# EAGLE design interconnexions (EAGLE 6.3)
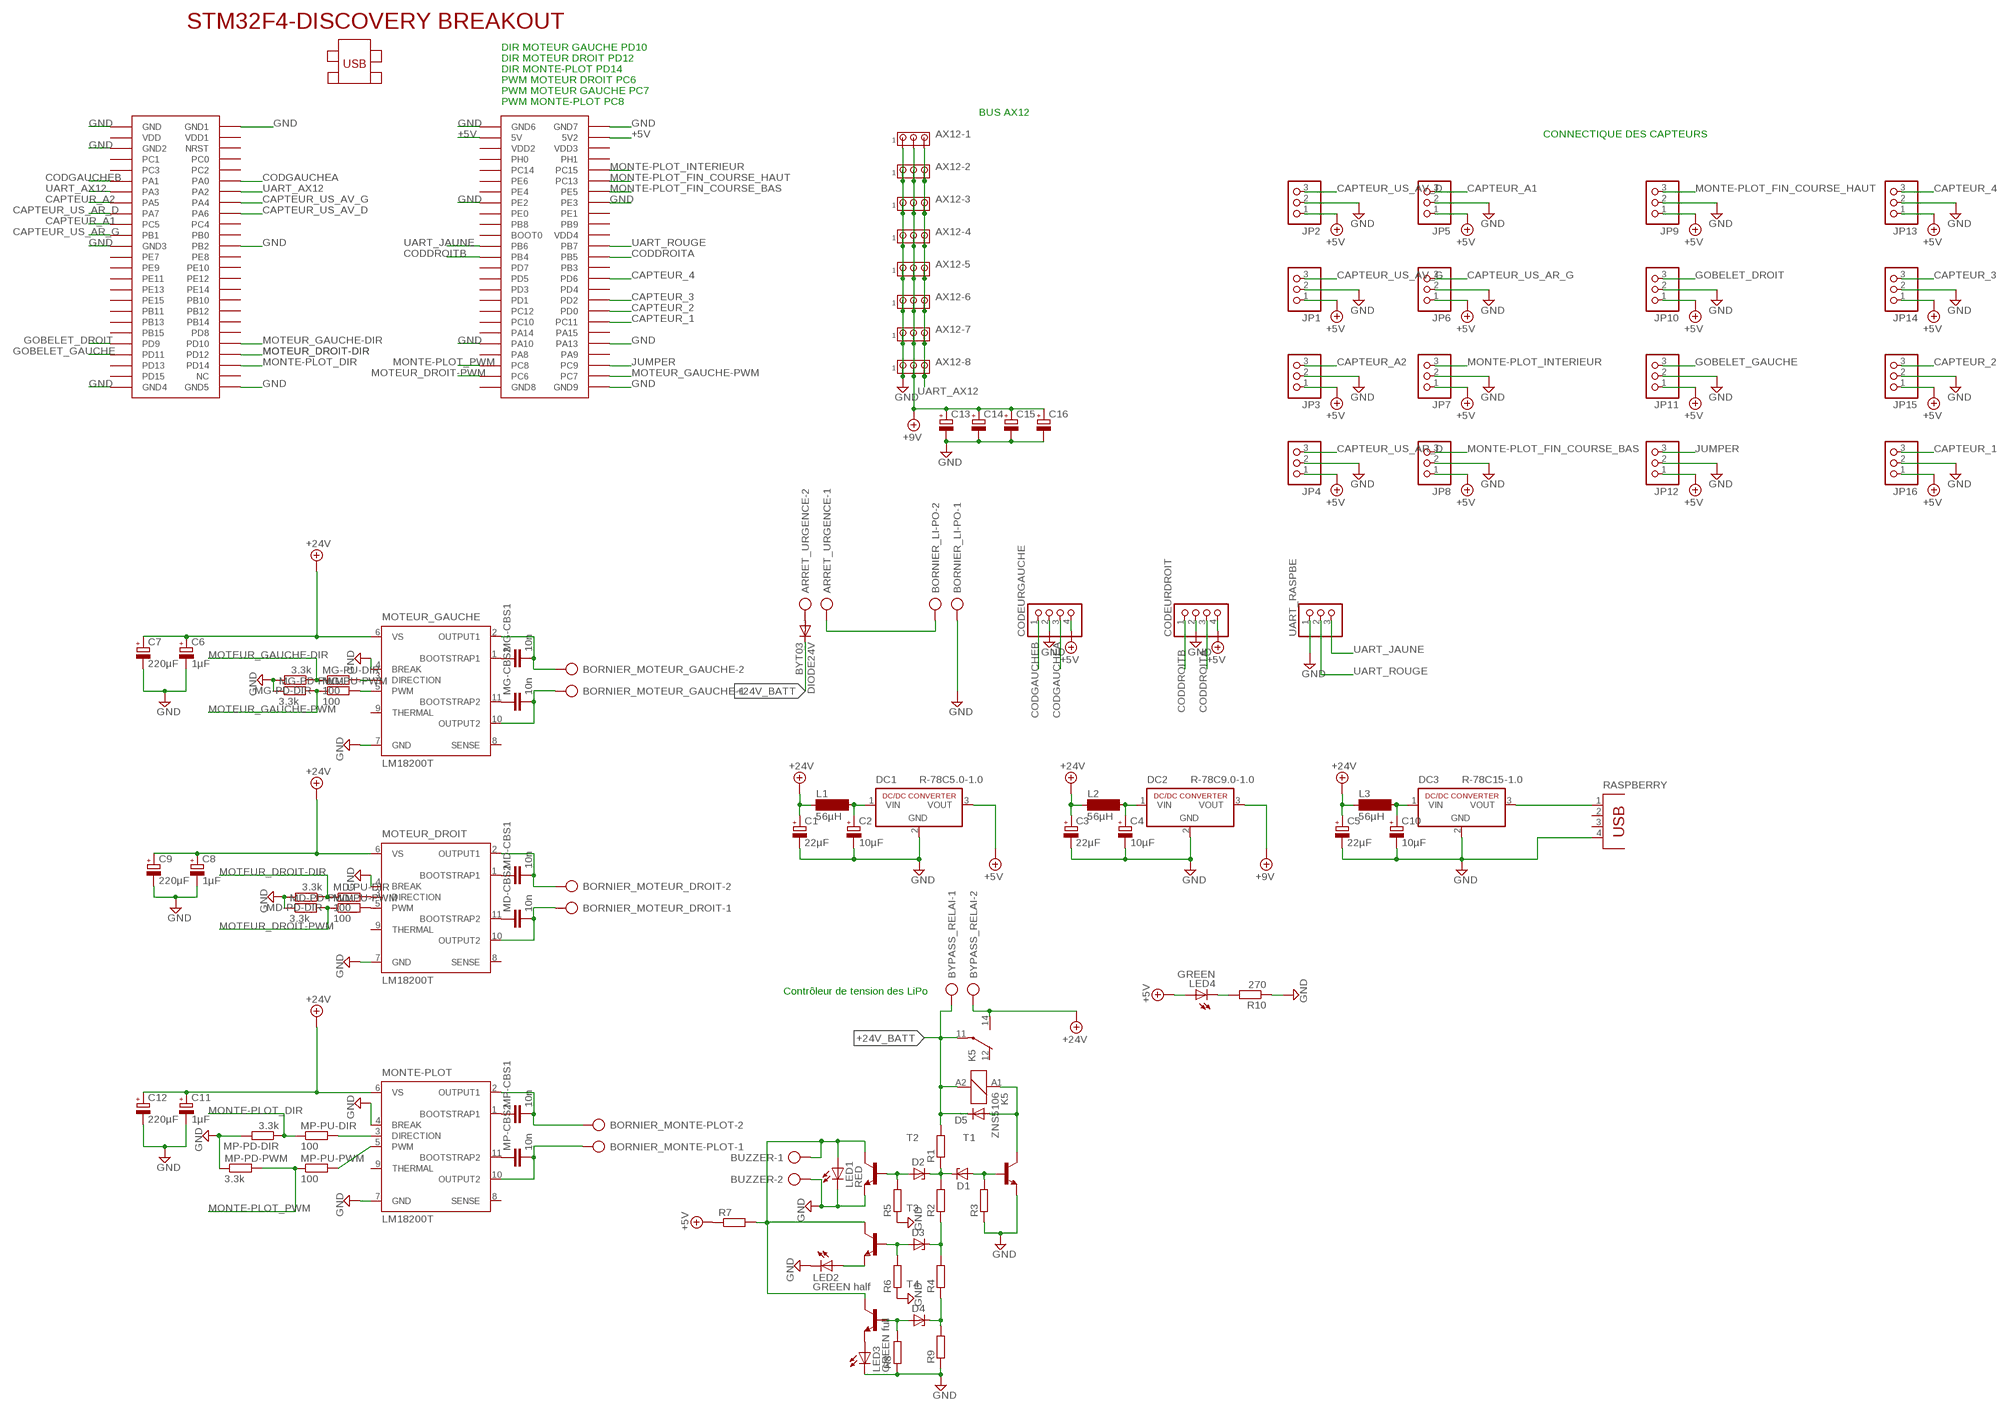
[diagram p0: schematic, sheet 1]

## Parts
ARRET_URGENCE  AK300/2  [AK300/2]
AX12-1  MTA03-100  [10X03MTA]
AX12-2  MTA03-100  [10X03MTA]
AX12-3  MTA03-100  [10X03MTA]
AX12-4  MTA03-100  [10X03MTA]
AX12-5  MTA03-100  [10X03MTA]
AX12-6  MTA03-100  [10X03MTA]
AX12-7  MTA03-100  [10X03MTA]
AX12-8  MTA03-100  [10X03MTA]
BORNIER_LI-PO  AK300/2  [AK300/2]
BORNIER_MONTE-PLOT  AK300/2  [AK300/2]
BORNIER_MOTEUR_DROIT  AK300/2  [AK300/2]
BORNIER_MOTEUR_GAUCHE  AK300/2  [AK300/2]
BUZZER  AK300/2  [AK300/2]
BYPASS_RELAI  AK300/2  [AK300/2]
C1  22µF  CPOL-EUE2,5-6E  [E2,5-6E]
C2  10µF  CPOL-EUE2,5-6E  [E2,5-6E]
C3  22µF  CPOL-EUE2,5-6E  [E2,5-6E]
C4  10µF  CPOL-EUE2,5-6E  [E2,5-6E]
C5  22µF  CPOL-EUE2,5-6E  [E2,5-6E]
C6  1µF  CPOL-EUE3.5-8  [E3,5-8]
C7  220µF  CPOL-EUE3.5-8  [E3,5-8]
C8  1µF  CPOL-EUE3.5-8  [E3,5-8]
C9  220µF  CPOL-EUE3.5-8  [E3,5-8]
C10  10µF  CPOL-EUE2,5-6E  [E2,5-6E]
C11  1µF  CPOL-EUE3.5-8  [E3,5-8]
C12  220µF  CPOL-EUE3.5-8  [E3,5-8]
C13  CPOL-EUE2,5-6E  [E2,5-6E]
C14  CPOL-EUE2,5-6E  [E2,5-6E]
C15  CPOL-EUE2,5-6E  [E2,5-6E]
C16  CPOL-EUE2,5-6E  [E2,5-6E]
CODEURDROIT  PINHD-1X4  [1X04]
CODEURGAUCHE  PINHD-1X4  [1X04]
D1  ZENER-DIODEZD-2.5  [ZDIO-2.5]
D2  ZENER-DIODEZD-2.5  [ZDIO-2.5]
D3  ZENER-DIODEZD-2.5  [ZDIO-2.5]
D4  ZENER-DIODEZD-2.5  [ZDIO-2.5]
D5  DIODE-D-2.5  [D-2.5]
DC1  R-78C5.0-1.0  [SIP3]
DC2  R-78C9.0-1.0  [SIP3]
DC3  R-78C15-1.0  [SIP3]
DIODE24V  BYT03  [DO27-15]
JP1  PINHD-1X3  [1X03]
JP2  PINHD-1X3  [1X03]
JP3  PINHD-1X3  [1X03]
JP4  PINHD-1X3  [1X03]
JP5  PINHD-1X3  [1X03]
JP6  PINHD-1X3  [1X03]
JP7  PINHD-1X3  [1X03]
JP8  PINHD-1X3  [1X03]
JP9  PINHD-1X3  [1X03]
JP10  PINHD-1X3  [1X03]
JP11  PINHD-1X3  [1X03]
JP12  PINHD-1X3  [1X03]
JP13  PINHD-1X3  [1X03]
JP14  PINHD-1X3  [1X03]
JP15  PINHD-1X3  [1X03]
JP16  PINHD-1X3  [1X03]
K5  ZNS5106  [ZN5]
L1  56µH  SD12K100  [SD12K100]
L2  56µH  SD12K100  [SD12K100]
L3  56µH  SD12K100  [SD12K100]
LED1  RED  LED5MM  [LED5MM]
LED2  GREEN half  LED5MM  [LED5MM]
LED3  GREEN full  LED5MM  [LED5MM]
LED4  GREEN  LED5MM  [LED5MM]
MD-CBS1  10n  C-EU050-025X075  [C050-025X075]
MD-CBS2  10n  C-EU050-025X075  [C050-025X075]
MD-PD-DIR  3.3k  R-EU_0207/10  [0207/10]
MD-PD-PWM  3.3k  R-EU_0207/7  [0207/7]
MD-PU-DIR  100  R-EU_0207/7  [0207/7]
MD-PU-PWM  100  R-EU_0207/15  [0207/15]
MG-CBS1  10n  C-EU050-025X075  [C050-025X075]
MG-CBS2  10n  C-EU050-025X075  [C050-025X075]
MG-PD-DIR  3.3k  R-EU_0207/7  [0207/7]
MG-PD-PWM  3.3k  R-EU_0207/7  [0207/7]
MG-PU-DIR  100  R-EU_0207/7  [0207/7]
MG-PU-PWM  100  R-EU_0207/15  [0207/15]
MONTE-PLOT  LM18200T  [TO-220-11]
MOTEUR_DROIT  LM18200T  [TO-220-11]
MOTEUR_GAUCHE  LM18200T  [TO-220-11]
MP-CBS1  10n  C-EU050-025X075  [C050-025X075]
MP-CBS2  10n  C-EU050-025X075  [C050-025X075]
MP-PD-DIR  3.3k  R-EU_0207/10  [0207/10]
MP-PD-PWM  3.3k  R-EU_0207/7  [0207/7]
MP-PU-DIR  100  R-EU_0207/7  [0207/7]
MP-PU-PWM  100  R-EU_0207/15  [0207/15]
R1  R-EU_0207/2V  [0207/2V]
R2  R-EU_0204/7  [0204/7]
R3  R-EU_0207/2V  [0207/2V]
R4  R-EU_0204/7  [0204/7]
R5  R-EU_0207/2V  [0207/2V]
R6  R-EU_0207/2V  [0207/2V]
R7  R-EU_0204/7  [0204/7]
R8  R-EU_0204/5  [0204/5]
R9  R-EU_0204/7  [0204/7]
R10  270  R-EU_0207/2V  [0207/2V]
RASPBERRY  PN87520  [PN87520]
T1  2N5400-NPN-TO92-CBE  [TO92-CBE]
T2  2N5400-NPN-TO92-CBE  [TO92-CBE]
T3  2N5400-NPN-TO92-CBE  [TO92-CBE]
T4  2N5400-NPN-TO92-CBE  [TO92-CBE]
U$1  STM32F4-DISCOVERY  [STM32F4-DISCOVERY]
UART_RASPBE  PINHD-1X3  [1X03]

## Nets
+5V: CODEURDROIT.4 CODEURGAUCHE.4 DC1.3(VOUT) JP1.1 JP2.1 JP3.1 JP4.1 JP5.1 JP6.1 JP7.1 JP8.1 JP9.1 JP10.1 JP11.1 JP12.1 JP13.1 JP14.1 JP15.1 JP16.1 LED4.A R7.1 U$1.P$53(5V) U$1.P$54(5V2)
+9V: AX12-1.2 AX12-2.2 AX12-3.2 AX12-4.2 AX12-5.2 AX12-6.2 AX12-7.2 AX12-8.2 C13.+ C14.+ C15.+ C16.+ DC2.3(VOUT)
+15V: DC3.3(VOUT) RASPBERRY.1
+24V: BYPASS_RELAI.2 C1.+ C3.+ C5.+ C6.+ C7.+ C8.+ C9.+ C11.+ C12.+ K5.14(2:S) L1.1 L2.1 L3.1 MONTE-PLOT.6(VS) MOTEUR_DROIT.6(VS) MOTEUR_GAUCHE.6(VS)
+24V_BATT: BYPASS_RELAI.1 D5.C DIODE24V.C K5.11(2:P) K5.A2 R1.2
CAPTEUR_1: JP16.3 U$1.P$88(PC11)
CAPTEUR_2: JP15.3 U$1.P$86(PD0)
CAPTEUR_3: JP14.3 U$1.P$84(PD2)
CAPTEUR_4: JP13.3 U$1.P$80(PD6)
CAPTEUR_A1: JP5.3 U$1.P$19(PC5)
CAPTEUR_A2: JP3.3 U$1.P$15(PA5)
CAPTEUR_US_AR_D: JP4.3 U$1.P$17(PA7)
CAPTEUR_US_AR_G: JP6.3 U$1.P$21(PB1)
CAPTEUR_US_AV_D: JP2.3 U$1.P$18(PA6)
CAPTEUR_US_AV_G: JP1.3 U$1.P$16(PA4)
CODDROITA: CODEURDROIT.3 U$1.P$76(PB5)
CODDROITB: CODEURDROIT.1 U$1.P$75(PB4)
CODGAUCHEA: CODEURGAUCHE.3 U$1.P$12(PA0)
CODGAUCHEB: CODEURGAUCHE.1 U$1.P$11(PA1)
GND: AX12-1.1 AX12-2.1 AX12-3.1 AX12-4.1 AX12-5.1 AX12-6.1 AX12-7.1 AX12-8.1 BORNIER_LI-PO.1 BUZZER.2 C1.- C2.- C3.- C4.- C5.- C6.- C7.- C8.- C9.- C10.- C11.- C12.- C13.- C14.- C15.- C16.- CODEURDROIT.2 CODEURGAUCHE.2 DC1.2(GND) DC2.2(GND) DC3.2(GND) JP1.2 JP2.2 JP3.2 JP4.2 JP5.2 JP6.2 JP7.2 JP8.2 JP9.2 JP10.2 JP11.2 JP12.2 JP13.2 JP14.2 JP15.2 JP16.2 LED1.K(C) LED2.K(C) LED3.K(C) MD-PD-DIR.2 MD-PD-PWM.1 MG-PD-DIR.2 MG-PD-PWM.1 MONTE-PLOT.4(BREAK) MONTE-PLOT.7(GND) MOTEUR_DROIT.4(BREAK) MOTEUR_DROIT.7(GND) MOTEUR_GAUCHE.4(BREAK) MOTEUR_GAUCHE.7(GND) MP-PD-DIR.2 MP-PD-PWM.1 R3.1 R5.1 R6.1 R8.1 R9.1 R10.1 RASPBERRY.4 T1.E T2.E U$1.P$1(GND) U$1.P$2(GND1) U$1.P$5(GND2) U$1.P$23(GND3) U$1.P$24(PB2) U$1.P$49(GND4) U$1.P$50(GND5) U$1.P$51(GND6) U$1.P$52(GND7) U$1.P$65(PE2) U$1.P$66(PE3) U$1.P$91(PA10) U$1.P$92(PA13) U$1.P$100(GND9) UART_RASPBE.1
GOBELET_DROIT: JP10.3 U$1.P$41(PD9)
GOBELET_GAUCHE: JP11.3 U$1.P$43(PD11)
JUMPER: JP12.3 U$1.P$96(PC9)
MONTE-PLOT_DIR: MP-PD-DIR.1 MP-PU-DIR.1 U$1.P$46(PD14)
MONTE-PLOT_FIN_COURSE_BAS: JP8.3 U$1.P$64(PE5)
MONTE-PLOT_FIN_COURSE_HAUT: JP9.3 U$1.P$62(PC13)
MONTE-PLOT_INTERIEUR: JP7.3 U$1.P$60(PC15)
MONTE-PLOT_PWM: MP-PD-PWM.2 MP-PU-PWM.1 U$1.P$95(PC8)
MOTEUR_DROIT-DIR: MD-PD-DIR.1 MD-PU-DIR.1 U$1.P$44(PD12)
MOTEUR_DROIT-PWM: MD-PD-PWM.2 MD-PU-PWM.1 U$1.P$97(PC6)
MOTEUR_GAUCHE-DIR: MG-PD-DIR.1 MG-PU-DIR.1 U$1.P$42(PD10)
MOTEUR_GAUCHE-PWM: MG-PD-PWM.2 MG-PU-PWM.1 U$1.P$98(PC7)
N$1: C2.+ DC1.1(VIN) L1.2
N$2: C4.+ DC2.1(VIN) L2.2
N$3: C10.+ DC3.1(VIN) L3.2
N$4: MONTE-PLOT.1(BOOTSTRAP1) MP-CBS1.1
N$5: MG-CBS1.1 MOTEUR_GAUCHE.1(BOOTSTRAP1)
N$6: MG-CBS2.1 MOTEUR_GAUCHE.11(BOOTSTRAP2)
N$7: MD-CBS2.1 MOTEUR_DROIT.11(BOOTSTRAP2)
N$8: MD-CBS1.1 MOTEUR_DROIT.1(BOOTSTRAP1)
N$9: BORNIER_MOTEUR_DROIT.2 MD-CBS1.2 MOTEUR_DROIT.2(OUTPUT1)
N$10: BORNIER_MOTEUR_DROIT.1 MD-CBS2.2 MOTEUR_DROIT.10(OUTPUT2)
N$11: BORNIER_MOTEUR_GAUCHE.1 MG-CBS2.2 MOTEUR_GAUCHE.10(OUTPUT2)
N$12: BORNIER_MOTEUR_GAUCHE.2 MG-CBS1.2 MOTEUR_GAUCHE.2(OUTPUT1)
N$13: MONTE-PLOT.11(BOOTSTRAP2) MP-CBS2.1
N$14: MG-PU-DIR.2 MOTEUR_GAUCHE.3(DIRECTION)
N$15: MG-PU-PWM.2 MOTEUR_GAUCHE.5(PWM)
N$16: MD-PU-DIR.2 MOTEUR_DROIT.3(DIRECTION)
N$17: MD-PU-PWM.2 MOTEUR_DROIT.5(PWM)
N$18: BORNIER_MONTE-PLOT.1 MONTE-PLOT.10(OUTPUT2) MP-CBS2.2
N$19: BORNIER_MONTE-PLOT.2 MONTE-PLOT.2(OUTPUT1) MP-CBS1.2
N$20: MONTE-PLOT.3(DIRECTION) MP-PU-DIR.2
N$21: MONTE-PLOT.5(PWM) MP-PU-PWM.2
N$22: LED4.K(C) R10.2
N$23: ARRET_URGENCE.1 BORNIER_LI-PO.2
N$24: D5.A K5.A1 T1.C
N$25: D1.C D2.C R1.1 R2.2
N$26: D1.A R3.2 T1.B
N$27: D2.A R5.2 T2.B
N$28: BUZZER.1 LED1.A R7.2 T2.C T3.C T4.C
N$29: D3.C R2.1 R4.2
N$30: LED2.A T3.E
N$31: D3.A R6.2 T3.B
N$32: LED3.A T4.E
N$33: D4.C R4.1 R9.2
N$34: D4.A R8.2 T4.B
N$38: ARRET_URGENCE.2 DIODE24V.A
UART_AX12: AX12-1.3 AX12-2.3 AX12-3.3 AX12-4.3 AX12-5.3 AX12-6.3 AX12-7.3 AX12-8.3 U$1.P$13(PA3) U$1.P$14(PA2)
UART_JAUNE: U$1.P$73(PB6) UART_RASPBE.3
UART_ROUGE: U$1.P$74(PB7) UART_RASPBE.2
Unconnected: K5.12(2:O) MONTE-PLOT.8(SENSE) MONTE-PLOT.9(THERMAL) MOTEUR_DROIT.8(SENSE) MOTEUR_DROIT.9(THERMAL) MOTEUR_GAUCHE.8(SENSE) MOTEUR_GAUCHE.9(THERMAL) RASPBERRY.2 RASPBERRY.3 U$1.P$3(VDD) U$1.P$4(VDD1) U$1.P$6(NRST) U$1.P$7(PC1) U$1.P$8(PC0) U$1.P$9(PC3) U$1.P$10(PC2) U$1.P$20(PC4) U$1.P$22(PB0) U$1.P$25(PE7) U$1.P$26(PE8) U$1.P$27(PE9) U$1.P$28(PE10) U$1.P$29(PE11) U$1.P$30(PE12) U$1.P$31(PE13) U$1.P$32(PE14) U$1.P$33(PE15) U$1.P$34(PB10) U$1.P$35(PB11) U$1.P$36(PB12) U$1.P$37(PB13) U$1.P$38(PB14) U$1.P$39(PB15) U$1.P$40(PD8) U$1.P$45(PD13) U$1.P$47(PD15) U$1.P$48(NC) U$1.P$55(VDD2) U$1.P$56(VDD3) U$1.P$57(PH0) U$1.P$58(PH1) U$1.P$59(PC14) U$1.P$61(PE6) U$1.P$63(PE4) U$1.P$67(PE0) U$1.P$68(PE1) U$1.P$69(PB8) U$1.P$70(PB9) U$1.P$71(BOOT0) U$1.P$72(VDD4) U$1.P$77(PD7) U$1.P$78(PB3) U$1.P$79(PD5) U$1.P$81(PD3) U$1.P$82(PD4) U$1.P$83(PD1) U$1.P$85(PC12) U$1.P$87(PC10) U$1.P$89(PA14) U$1.P$90(PA15) U$1.P$93(PA8) U$1.P$94(PA9) U$1.P$99(GND8)

## Notes on the sheet
- DIR MOTEUR GAUCHE PD10
- DIR MOTEUR DROIT PD12
- DIR MONTE-PLOT PD14
- PWM MOTEUR DROIT PC6
- PWM MOTEUR GAUCHE PC7
- PWM MONTE-PLOT PC8
- BUS AX12
- CONNECTIQUE DES CAPTEURS
- Contrôleur de tension des LiPo

## Library data of the parts
ARRET_URGENCE BORNIER_LI-PO BORNIER_MONTE-PLOT BORNIER_MOTEUR_DROIT BORNIER_MOTEUR_GAUCHE BUZZER BYPASS_RELAI = con-ptr500:AK300/2: CONNECTOR; OC_FARNELL: unknown; OC_NEWARK: unknown
AX12-1-AX12-8 = con-amp:MTA03-100: AMP connector
C1-C5 C10 C13-C16 = resistor:CPOL-EU: POLARIZED CAPACITOR, European symbol
C6-C9 C11 C12 = rcl:CPOL-EU: POLARIZED CAPACITOR, European symbol
CODEURDROIT CODEURGAUCHE = pinhead:PINHD-1X4: PIN HEADER
D1-D4 = diode:ZENER-DIODE: Z-Diode
D5 = diode:DIODE-: DIODE
DC1-DC3 = dc-dc-converter:R-78C*-1.0: INNOLINE DC/DC-Converter 1.0 AMP SIP3 Single Output Source: Data sheet <http://www.mikrocontroller.net/attachment/150645/157764-da-01-en-DC_DC_WANDLER_R_78C5_0_1_0.pdf>
DIODE24V = diode:BYT03: DIODE ultra fast
JP1-JP16 UART_RASPBE = pinhead:PINHD-1X3: PIN HEADER
K5 = relay:ZNS5*: Miniature Power PCB Relay SCHRACK 1pole 10 A Source: http://www.schrack.com/.. 5847.pdf; OC_FARNELL: unknown; OC_NEWARK: unknown
L1-L3 = inductor-neosid:SD12: INDUCTOR nominal inductance; OC_FARNELL: unknown; OC_NEWARK: unknown
LED1-LED4 = led:LED: LED OSRAM: - CHIPLED LG R971, LG N971, LY N971, LG Q971, LY Q971, LO R971, LY R971 LH N974, LH R974 LS Q976, LO Q976, LY Q976 LO Q996 - Hyper CHIPLED LW Q18S LB Q993, LB Q99A, LB R99A - SideLED LS A670, LO A670, LY A670, LG A670, LP A670 LB A673, LV A673, LT A673, LW A673 LH A674 LY A675 LS A676, LA A676, LO A676, LY A676, LW A676 LS A679, LY A679, LG A679 - Hyper Micro SIDELED® LS Y876, LA Y876, LO Y876, LY Y876 LT Y87S - SmartLED LW L88C, LW L88S LB L89C, LB L89S, LG L890 LS L89K, LO L89K, LY L89K LS L896, LA L896, LO L896, LY L896 - TOPLED LS T670, LO T670, LY T670, LG T670, LP T670 LSG T670, LSP T670, LSY T670, LOP T670, LYG T670 LG T671, LOG T671, LSG T671 LB T673, LV T673, LT T673, LW T673 LH T674 LS T676, LA T676, LO T676, LY T676, LB T676, LH T676, LSB T676, LW T676 LB T67C, LV T67C, LT T67C, LS T67K, LO T67K, LY T67K, LW E67C LS E67B, LA E67B, LO E67B, LY E67B, LB E67C, LV E67C, LT E67C LW T67C LS T679, LY T679, LG T679 LS T770, LO T770, LY T770, LG T770, LP T770 LB T773, LV T773, LT T773, LW T773 LH T774 LS E675, LA E675, LY E675, LS T675 LS T776, LA T776, LO T776, LY T776, LB T776 LHGB T686 LT T68C, LB T68C - Hyper Mini TOPLED® LB M676 - Mini TOPLED Santana® LG M470 LS M47K, LO M47K, LY M47K Source: http://www.osram.convergy.de LUXEON: - LUMILED® LXK2-PW12-R00, LXK2-PW12-S00, LXK2-PW14-U00, LXK2-PW14-V00 LXK2-PM12-R00, LXK2-PM12-S00, LXK2-PM14-U00 LXK2-PE12-Q00, LXK2-PE12-R00, LXK2-PE12-S00, LXK2-PE14-T00, LXK2-PE14-U00 LXK2-PB12-K00, LXK2-PB12-L00, LXK2-PB12-M00, LXK2-PB14-N00, LXK2-PB14-P00, LXK2-PB14-Q00 LXK2-PR12-L00, LXK2-PR12-M00, LXK2-PR14-Q00, LXK2-PR14-R00 LXK2-PD12-Q00, LXK2-PD12-R00, LXK2-PD12-S00 LXK2-PH12-R00, LXK2-PH12-S00 LXK2-PL12-P00, LXK2-PL12-Q00, LXK2-PL12-R00 Source: www.luxeon.com KINGBRIGHT: KA-3528ASYC Source: www.kingbright.com
MD-CBS1 MD-CBS2 MG-CBS1 MG-CBS2 MP-CBS1 MP-CBS2 = rcl:C-EU: CAPACITOR, European symbol
MD-PD-DIR MD-PU-DIR MG-PD-DIR MG-PU-DIR MP-PD-DIR MP-PU-DIR R1 R8 R10 = rcl:R-EU_: RESISTOR, European symbol
MD-PD-PWM MD-PU-PWM MG-PD-PWM MG-PU-PWM MP-PD-PWM MP-PU-PWM R2-R7 R9 = resistor:R-EU_: RESISTOR, European symbol
MONTE-PLOT MOTEUR_DROIT MOTEUR_GAUCHE = national-semiconductor:LM18200T: 3A, 55V H-Bridge Motor Control SourcE: http://cache.national.com/ds/LM/LMD18200.pdf; OC_FARNELL: unknown; OC_NEWARK: unknown
RASPBERRY = con-berg:PN87520: BERG USB connector; OC_FARNELL: unknown; OC_NEWARK: unknown
T1-T4 = transistor:*-NPN-: NPN Transistror BF959 corrected 2008.03.06
U$1 = STM32F4-DISCOVERY:STM32F4-DISCOVERY

## Board
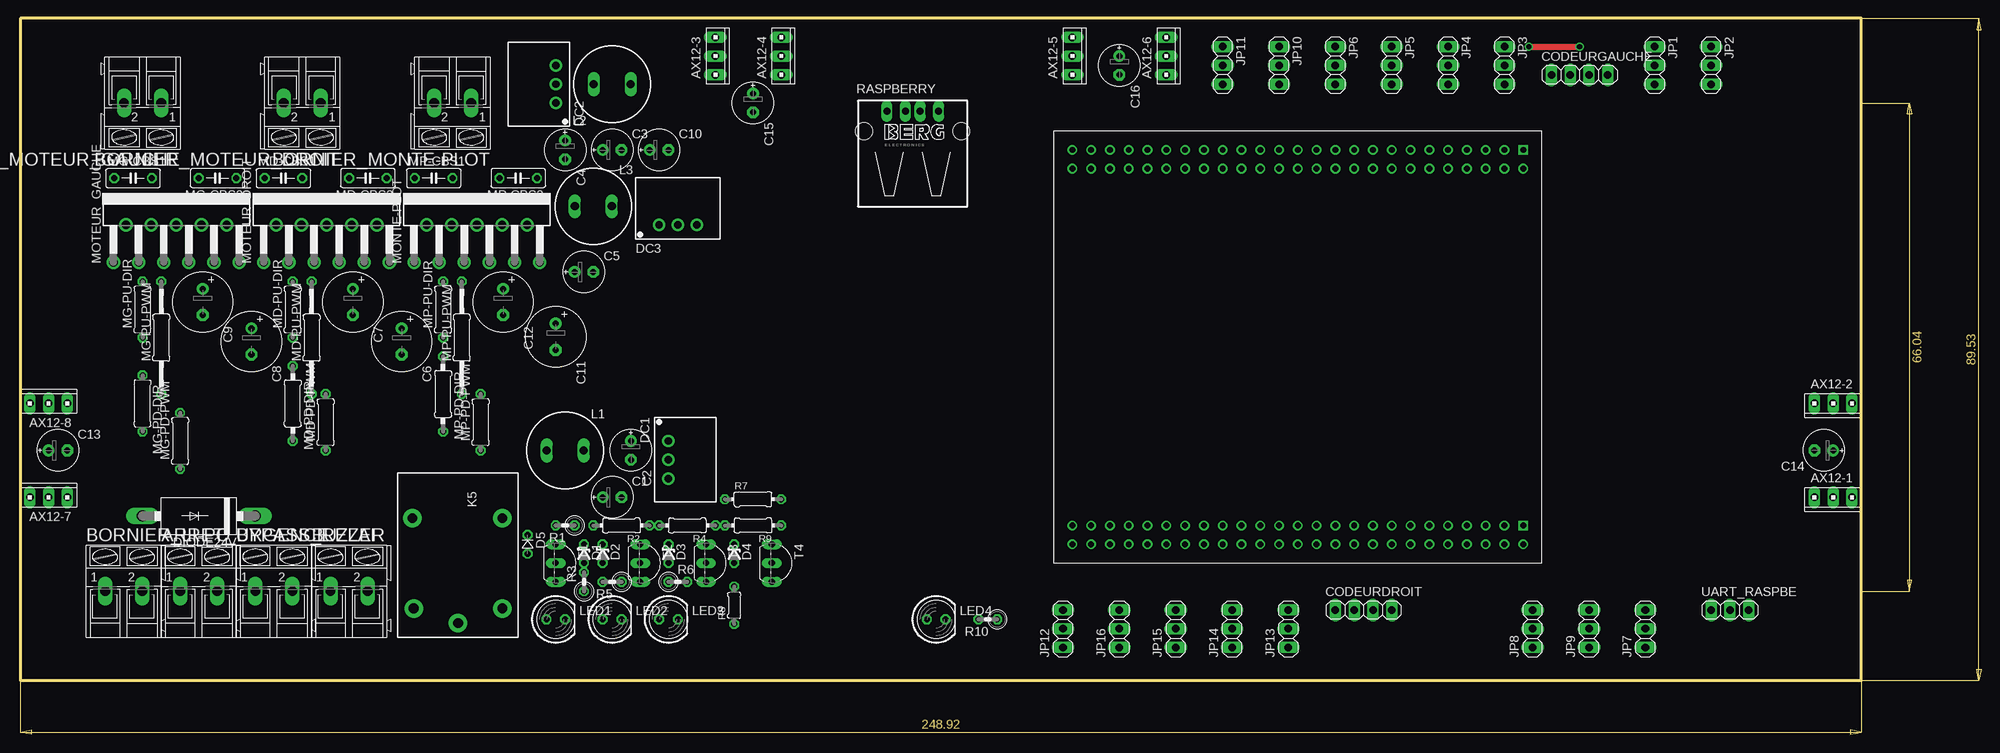
[diagram p1: board, top side]
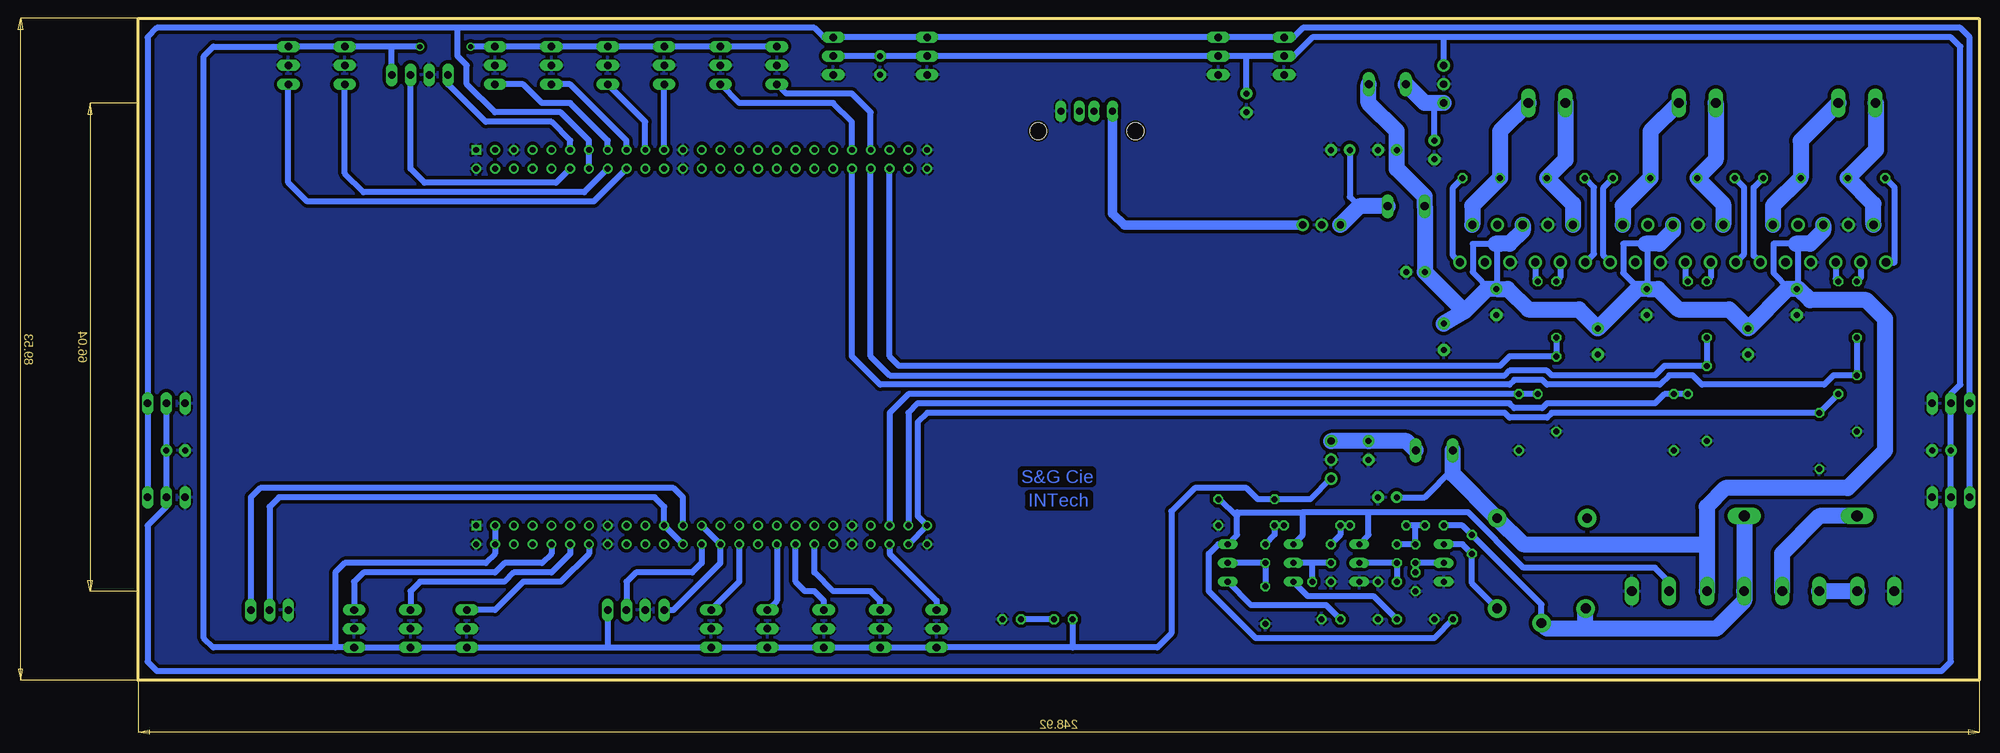
[diagram p2: board, bottom side, seen from below]

Size 248.92 x 89.53 mm. Coordinates in mm from the lower left corner, seen from the top.
Outline: 0,0 248.92,0 248.92,89.53 0,89.53 0,0
Copper layers (1*16): Top 0.035mm / dielectric 1.5mm / Bottom 0.035mm
Design rules "default *": minimum track width 10mil, minimum drill 24mil, track to track 18mil, track to pad 18mil, pad to pad 12mil, via to via 12mil, smd to smd 12mil, copper to edge 10mil, drill to drill 8mil, minimum pad ring 10mil, minimum via ring 8mil, stop-mask expansion 4mil, vias tented up to drill 0mil, thermal gap 10mil
tKeepout: area 110.5,14.6 to 130.8,62.9

### Footprints (pad centres in the part's own frame; a part is rotated, then mirrored left to right if it is on the bottom)
AK300/2 = drill 1.321 long: 1 -2.515,0; 2 2.489,0
10X03MTA = drill 1.016 long: 1 2.54,0; 2 0,0; 3 -2.54,0
E2,5-6E = drill 0.813 pad 1.575: + -1.27,0 | drill 0.813 pad 1.575 octagon: - 1.27,0
E3,5-8 = drill 0.813 pad 1.6: + -1.778,0 | drill 0.813 pad 1.6 octagon: - 1.778,0
1X04 = drill 1.016 long: 1 -3.81,0; 2 -1.27,0; 3 1.27,0; 4 3.81,0
ZDIO-2.5 = drill 0.813 octagon: A 1.27,0; C -1.27,0
D-2.5 = drill 0.813 octagon: A 1.27,0; C -1.27,0
SIP3 = drill 1 pad 1.676: 1 -2.54,0; 2 0,0; 3 2.54,0
DO27-15 = drill 1.499 long: A 7.62,0; C -7.62,0
1X03 = drill 1.016 long: 1 -2.54,0; 2 0,0; 3 2.54,0
ZN5 = drill 1.3 pad 2.5: 11 8.89,0; 12 -5.31,-6.2; 14 -5.31,6; A1 6.89,6; A2 6.89,-6
SD12K100 = drill 1.1 long: 1 -2.5,0; 2 2.5,0
LED5MM = drill 0.813 octagon: A -1.27,0; K 1.27,0
C050-025X075 = drill 0.813 octagon: 1 -2.54,0; 2 2.54,0
0207/10 = drill 0.813 octagon: 1 -5.08,0; 2 5.08,0
0207/7 = drill 0.813 octagon: 1 -3.81,0; 2 3.81,0
0207/15 = drill 0.813 octagon: 1 -7.62,0; 2 7.62,0
TO-220-11 = drill 1.1 pad 1.778: 1 -8.5,-9.37; 2 -6.8,-4.29; 3 -5.1,-9.37; 4 -3.4,-4.29; 5 -1.7,-9.37; 6 0,-4.29; 7 1.7,-9.37; 8 3.4,-4.29; 9 5.1,-9.37; 10 6.8,-4.29; 11 8.5,-9.37
0207/2V = drill 0.813 octagon: 1 -1.27,0; 2 1.27,0
0204/7 = drill 0.813 octagon: 1 -3.81,0; 2 3.81,0
0204/5 = drill 0.813 octagon: 1 -2.54,0; 2 2.54,0
PN87520 = drill 0.95 long: 1 -3.5,2.71; 2 -1,2.71; 3 1,2.71; 4 3.5,2.71 | hole 2.3: -6.57,0; 6.57,0
TO92-CBE = drill 0.813 long: B 0,0; C -2.54,0; E 2.54,0
STM32F4-DISCOVERY = drill 0.8 square: P$1 -27.94,30.48; P$51 22.86,30.48 | drill 0.8: P$2 -25.4,30.48; P$3 -27.94,27.94; P$4 -25.4,27.94; P$5 -27.94,25.4; P$6 -25.4,25.4; P$7 -27.94,22.86; P$8 -25.4,22.86; P$9 -27.94,20.32; P$10 -25.4,20.32; P$11 -27.94,17.78; P$12 -25.4,17.78; P$13 -27.94,15.24; P$14 -25.4,15.24; P$15 -27.94,12.7; P$16 -25.4,12.7; P$17 -27.94,10.16; P$18 -25.4,10.16; P$19 -27.94,7.62; P$20 -25.4,7.62; P$21 -27.94,5.08; P$22 -25.4,5.08; P$23 -27.94,2.54; P$24 -25.4,2.54; P$25 -27.94,0; P$26 -25.4,0; P$27 -27.94,-2.54; P$28 -25.4,-2.54; P$29 -27.94,-5.08; P$30 -25.4,-5.08; P$31 -27.94,-7.62; P$32 -25.4,-7.62; P$33 -27.94,-10.16; P$34 -25.4,-10.16; P$35 -27.94,-12.7; P$36 -25.4,-12.7; P$37 -27.94,-15.24; P$38 -25.4,-15.24; P$39 -27.94,-17.78; P$40 -25.4,-17.78; P$41 -27.94,-20.32; P$42 -25.4,-20.32; P$43 -27.94,-22.86; P$44 -25.4,-22.86; P$45 -27.94,-25.4; P$46 -25.4,-25.4; P$47 -27.94,-27.94; P$48 -25.4,-27.94; P$49 -27.94,-30.48; P$50 -25.4,-30.48; P$52 25.4,30.48; P$53 22.86,27.94; P$54 25.4,27.94; P$55 22.86,25.4; P$56 25.4,25.4; P$57 22.86,22.86; P$58 25.4,22.86; P$59 22.86,20.32; P$60 25.4,20.32; P$61 22.86,17.78; P$62 25.4,17.78; P$63 22.86,15.24; P$64 25.4,15.24; P$65 22.86,12.7; P$66 25.4,12.7; P$67 22.86,10.16; P$68 25.4,10.16; P$69 22.86,7.62; P$70 25.4,7.62; P$71 22.86,5.08; P$72 25.4,5.08; P$73 22.86,2.54; P$74 25.4,2.54; P$75 22.86,0; P$76 25.4,0; P$77 22.86,-2.54; P$78 25.4,-2.54; P$79 22.86,-5.08; P$80 25.4,-5.08; P$81 22.86,-7.62; P$82 25.4,-7.62; P$83 22.86,-10.16; P$84 25.4,-10.16; P$85 22.86,-12.7; P$86 25.4,-12.7; P$87 22.86,-15.24; P$88 25.4,-15.24; P$89 22.86,-17.78; P$90 25.4,-17.78; P$91 22.86,-20.32; P$92 25.4,-20.32; P$93 22.86,-22.86; P$94 25.4,-22.86; P$95 22.86,-25.4; P$96 25.4,-25.4; P$97 22.86,-27.94; P$98 25.4,-27.94; P$99 22.86,-30.48; P$100 25.4,-30.48

### Placement (x,y rotation side)
ARRET_URGENCE  24.13,12.07 0 top
AX12-1  245.11,24.77 180 top
AX12-2  245.11,37.47 180 top
AX12-3  93.98,84.46 270 top
AX12-4  102.87,84.46 270 top
AX12-5  142.24,84.46 270 top
AX12-6  154.94,84.46 270 top
AX12-7  3.81,24.77 0 top
AX12-8  3.81,37.47 0 top
BORNIER_LI-PO  13.97,12.07 0 top
BORNIER_MONTE-PLOT  58.42,78.1 180 top
BORNIER_MOTEUR_DROIT  38.1,78.1 180 top
BORNIER_MOTEUR_GAUCHE  16.51,78.1 180 top
BUZZER  44.45,12.07 0 top
BYPASS_RELAI  34.29,12.07 0 top
C1  80.01,24.77 0 top
C2  82.55,31.12 270 top
C3  80.01,71.75 0 top
C4  73.66,71.75 270 top
C5  76.2,55.24 0 top
C6  51.56,45.85 270 top
C7  44.96,51.18 270 top
C8  31.24,45.85 270 top
C9  24.64,51.18 270 top
C10  86.36,71.75 0 top
C11  72.39,46.48 270 top
C12  65.28,51.18 270 top
C13  5.08,31.12 0 top
C14  243.84,31.12 180 top
C15  99.06,78.1 270 top
C16  148.59,83.19 270 top
CODEURDROIT  181.61,9.53 0 top
CODEURGAUCHE  210.82,81.91 0 top
D1  76.2,17.14 270 top
D2  78.74,17.14 270 top
D3  87.63,17.14 270 top
D4  96.52,17.14 270 top
D5  68.58,18.41 270 top
DC1  87.63,29.84 270 top
DC2  72.39,80.65 90 top
DC3  88.9,61.59 0 top
DIODE24V  24.13,22.23 180 top
JP1  220.98,83.19 270 top
JP2  228.6,83.19 270 top
JP3  200.66,83.19 270 top
JP4  193.04,83.19 270 top
JP5  185.42,83.19 270 top
JP6  177.8,83.19 270 top
JP7  219.71,6.99 90 top
JP8  204.47,6.99 90 top
JP9  212.09,6.99 90 top
JP10  170.18,83.19 270 top
JP11  162.56,83.19 270 top
JP12  140.97,6.99 90 top
JP13  171.45,6.99 90 top
JP14  163.83,6.99 90 top
JP15  156.21,6.99 90 top
JP16  148.59,6.99 90 top
K5  59.18,16.64 270 top
L1  73.66,31.12 0 top
L2  80.01,80.65 180 top
L3  77.47,64.13 0 top
LED1  72.39,8.26 0 top
LED2  80.01,8.26 0 top
LED3  87.63,8.26 0 top
LED4  123.83,8.26 0 top
MD-CBS1  35.56,67.94 0 top
MD-CBS2  46.99,67.94 180 top
MD-PD-DIR  36.83,37.47 270 top
MD-PD-PWM  41.27,34.92 90 top
MD-PU-DIR  36.83,50.16 90 top
MD-PU-PWM  39.37,46.35 90 top
MG-CBS1  15.24,67.94 0 top
MG-CBS2  26.67,67.94 180 top
MG-PD-DIR  16.51,37.47 270 top
MG-PD-PWM  21.59,32.39 90 top
MG-PU-DIR  16.51,50.16 90 top
MG-PU-PWM  19.05,46.35 90 top
MONTE-PLOT  61.72,65.91 0 top
MOTEUR_DROIT  41.4,65.91 0 top
MOTEUR_GAUCHE  21.08,65.91 0 top
MP-CBS1  55.88,67.94 0 top
MP-CBS2  67.31,67.94 180 top
MP-PD-DIR  57.15,38.73 270 top
MP-PD-PWM  62.23,34.92 90 top
MP-PU-DIR  57.15,50.16 90 top
MP-PU-PWM  59.69,46.35 90 top
R1  73.66,20.96 180 top
R2  81.28,20.96 180 top
R3  76.2,13.34 90 top
R4  90.17,20.96 180 top
R5  80.01,13.34 180 top
R6  88.9,13.34 0 top
R7  99.06,24.51 0 top
R8  96.52,10.16 90 top
R9  99.06,20.96 180 top
R10  130.81,8.26 180 top
RASPBERRY  120.65,74.29 0 top
T1  72.39,15.88 270 top
T2  83.82,15.88 270 top
T3  92.71,15.88 270 top
T4  101.6,15.88 270 top
U$1  172.72,43.81 270 top
UART_RASPBE  231.14,9.53 0 top

### Tracks (layer width: path | path; a pad name or v marks a point on that pad's centre or on a via)
+5V  (via drill 0.7)
  Top 0.813: v203.96,85.72 v210.82,85.72
  Bottom 0.813: DC1.3 90.42,24.51 R7.1 97.54,24.51 99.06,26.04 106.05,26.04 109.22,22.86 109.22,6.35 111.12,4.45 122.56,4.45 | JP11.1 JP10.1 JP6.1 JP5.1 JP4.1 JP3.1 v203.96,85.72 | 222.25,4.45 JP7.1 JP9.1 JP8.1 185.42,4.45 | 222.25,4.45 238.76,4.45 240.03,5.71 240.03,84.46 238.76,85.72 JP2.1 JP1.1 214.63,85.72 | 185.42,4.45 JP13.1 JP14.1 JP15.1 JP16.1 JP12.1 122.56,4.45 | CODEURDROIT.4 185.42,4.45 | U$1.P$53 U$1.P$54 200.66,17.14 201.93,15.88 220.98,15.88 222.25,14.61 222.25,4.45 | v210.82,85.72 214.63,85.72 | CODEURGAUCHE.4 214.63,85.72 | LED4.A 122.56,4.45
+9V
  Bottom 0.813: 72.39,87 3.81,87 2.54,85.72 2.54,40.01 3.81,38.73 AX12-8.2 C13.+ AX12-7.2 3.81,2.54 5.08,1.27 246.38,1.27 247.65,2.54 247.65,20.96 245.11,23.5 AX12-1.2 | 72.39,87 90.17,87 92.71,84.46 AX12-3.2 99.06,84.46 | 99.06,84.46 AX12-4.2 AX12-5.2 C16.+ AX12-6.2 | C15.+ 99.06,84.46 | AX12-1.2 C14.+ AX12-2.2 AX12-1.2 | DC2.3 72.39,87
+15V
  Bottom 1.27: RASPBERRY.1 117.15,63.17 115.57,61.59 DC3.3
+24V
  Bottom 0.406: 44.7,58.29 44.86,58.29 44.96,58.29 | 65.28,58.55 65.18,58.55 65.02,58.55 | 26.16,53.47 25.91,53.47 25.91,52.96
  Bottom 0.813: 24.38,53.21 C9.+ 24.64,53.62 24.54,53.62 24.54,59.05 | 43.18,59.05 44.45,59.05 44.96,58.55 | 65.28,58.55 64.77,59.05 | C1.+ 74.97,24.77 71.16,28.57 | 46.23,52.96 45.72,52.96 45.72,52.7 48.13,55.12 48.13,59.05 45.09,59.05 | 44.86,58.29 44.86,52.96 | 66.55,52.96 66.04,52.96 66.04,52.7 68.45,55.24 68.45,59.05 65.41,59.05 | 65.18,58.55 65.18,52.83 | 25.4,59.05 27.81,59.05 27.81,55.14 25.72,53.02 | 25.72,53.02 25.4,52.7 | 25.91,52.96 25.72,52.96 25.72,53.02
  Bottom 2.184: 69.6,49.91 66.55,52.96 C12.+ 63.75,52.96 60.96,50.16 54.1,50.16 C6.+ 46.23,52.96 C7.+ 44.86,52.96 43.43,52.96 40.64,50.16 33.78,50.16 C8.+ 25.91,52.96 C9.+ 24.38,52.96 22.86,51.44 15.24,51.44 12.7,48.9 12.7,31.12 17.78,26.04 34.29,26.04 36.83,23.5 36.83,18.41 | 69.6,49.91 C11.+ | MOTEUR_DROIT.6 41.4,60.83 43.18,59.05 45.09,59.05 | MONTE-PLOT.6 61.72,60.83 63.5,59.05 64.77,59.05 65.41,59.05 | 36.83,18.41 36.83,12.07 BYPASS_RELAI.2 | 36.83,18.41 61.65,18.41 K5.14 71.16,27.93 71.16,28.57 L1.1 | 69.6,49.91 C5.+ 74.97,55.29 L3.1 74.97,65.44 78.74,69.22 C3.+ 78.74,74.29 82.55,78.1 82.55,80.6 L2.1 | MOTEUR_GAUCHE.6 21.08,60.83 22.86,59.05 24.54,59.05 24.77,59.05
+24V_BATT
  Bottom 0.813: K5.11 59.18,10.29 D5.C 69.85,20.96 R1.2
  Bottom 2.184: DIODE24V.C 31.75,12.09 BYPASS_RELAI.1 31.77,10.77 35.56,6.99 53.34,6.99 | 53.34,6.99 58.42,6.99 K5.11 | K5.A2 53.34,9.59 53.34,6.99
CAPTEUR_1
  Bottom 0.813: JP16.3 148.59,10.79 149.86,12.07 154.94,12.07 157.48,14.61 U$1.P$88
CAPTEUR_2
  Bottom 0.813: JP15.3 156.21,10.79 157.48,12.07 158.75,12.07 160.02,13.34 U$1.P$86
CAPTEUR_3
  Bottom 0.813: U$1.P$84 162.56,10.79 JP14.3
CAPTEUR_4
  Bottom 0.813: U$1.P$80 167.64,13.34 JP13.3
CAPTEUR_A1
  Bottom 0.813: U$1.P$19 180.34,75.56 JP5.3
CAPTEUR_A2
  Bottom 0.813: U$1.P$15 185.42,73.03 190.5,78.1 194.31,78.1 196.85,80.65 JP3.3
CAPTEUR_US_AR_D
  Bottom 0.813: U$1.P$17 182.88,73.03 190.5,80.65 JP4.3
CAPTEUR_US_AR_G
  Bottom 0.813: U$1.P$21 JP6.3
CAPTEUR_US_AV_D
  Bottom 0.813: U$1.P$18 187.32,64.77 226.06,64.77 228.6,67.31 JP2.3
CAPTEUR_US_AV_G
  Bottom 0.813: U$1.P$16 188.59,66.04 218.44,66.04 220.98,68.58 JP1.3
CODDROITA
  Bottom 0.813: U$1.P$76 172.72,15.88 173.99,14.61 181.61,14.61 182.88,13.34 CODEURDROIT.3
CODDROITB
  Bottom 0.813: CODEURDROIT.1 176.53,9.53 170.18,15.88 170.18,18.41 U$1.P$75
CODGAUCHEA
  Bottom 0.813: U$1.P$12 192.41,67.31 210.19,67.31 212.09,69.22 CODEURGAUCHE.3
CODGAUCHEB
  Bottom 0.813: U$1.P$11 190.5,73.03 193.04,75.56 201.93,75.56 207.01,80.65 CODEURGAUCHE.1
GND
  pour Bottom: 0,89.53 248.92,89.53 248.92,0.64 0,0.64
  pour Bottom: 0,89.53 248.92,89.53 248.92,0.64 0,0.64
GOBELET_DROIT
  Bottom 0.813: U$1.P$41 152.4,75.56 154.94,78.1 167.64,78.1 JP10.3
GOBELET_GAUCHE
  Bottom 0.813: U$1.P$43 149.86,76.84 152.4,79.38 161.29,79.38 JP11.3
JUMPER
  Bottom 0.813: U$1.P$96 147.32,17.14 140.97,10.79 JP12.3
MONTE-PLOT_DIR
  Bottom 0.813: MP-PU-DIR.1 MP-PD-DIR.1 63.5,43.81 64.77,42.55 146.05,42.55 147.32,43.81 U$1.P$46
MONTE-PLOT_FIN_COURSE_BAS
  Bottom 0.813: U$1.P$64 187.96,17.14 191.77,13.34 196.85,13.34 200.66,9.53 JP8.3
MONTE-PLOT_FIN_COURSE_HAUT
  Bottom 0.813: U$1.P$62 190.5,17.14 193.04,14.61 198.12,14.61 199.39,13.34 210.82,13.34 212.09,12.07 JP9.3
MONTE-PLOT_INTERIEUR
  Bottom 0.813: U$1.P$60 193.04,17.14 194.31,15.88 199.39,15.88 200.66,14.61 218.44,14.61 219.71,13.34 JP7.3
MONTE-PLOT_PWM
  Bottom 0.813: MP-PD-PWM.2 MP-PU-PWM.1 144.78,38.73 147.32,36.2 U$1.P$95
MOTEUR_DROIT-DIR
  Bottom 0.813: MD-PU-DIR.1 MD-PD-DIR.1 42.55,42.55 43.81,41.27 57.78,41.27 58.42,41.91 63.5,41.91 64.14,41.27 147.32,41.27 149.86,43.81 U$1.P$44
MOTEUR_DROIT-PWM
  Bottom 0.813: MD-PU-PWM.1 MD-PD-PWM.2 42.55,38.73 43.81,37.47 58.42,37.47 59.05,36.83 62.87,36.83 63.5,37.47 143.51,37.47 144.78,36.2 U$1.P$97
MOTEUR_GAUCHE-DIR
  Bottom 0.813: MG-PU-DIR.1 MG-PD-DIR.1 19.68,41.27 20.95,40.01 37.47,40.01 38.73,41.27 41.91,41.27 43.18,40.01 58.42,40.01 59.05,40.64 62.87,40.64 63.5,40.01 148.59,40.01 152.4,43.81 U$1.P$42
MOTEUR_GAUCHE-PWM
  Bottom 0.813: MG-PU-PWM.1 MG-PD-PWM.2 57.78,36.2 58.42,35.56 63.5,35.56 64.14,36.2 142.24,36.2 143.51,34.92 143.51,22.23 142.24,20.96 U$1.P$98
N$1
  Bottom 2.184: L1.2 77.43,32.39 C2.+ DC1.1
N$2
  Bottom 0.813: C4.+ 73.66,78.1
  Bottom 2.184: DC2.1 73.66,78.1 74.97,78.1 L2.2
N$3
  Bottom 0.813: C10.+ 85.09,65.41 83.82,64.13
  Bottom 2.184: L3.2 83.82,64.13 DC3.1
N$4
  Bottom 0.813: MONTE-PLOT.1 52.07,57.7 52.07,66.67 MP-CBS1.1
N$5
  Bottom 0.813: MOTEUR_GAUCHE.1 11.43,56.54 11.43,66.67 MG-CBS1.1
N$6
  Bottom 0.813: MOTEUR_GAUCHE.11 30.48,57.44 30.48,66.67 MG-CBS2.1
N$7
  Bottom 0.813: MOTEUR_DROIT.11 50.8,57.44 50.8,66.67 MD-CBS2.1
N$8
  Bottom 0.813: MOTEUR_DROIT.1 31.75,57.7 31.75,66.67 MD-CBS1.1
N$9
  Bottom 2.184: BORNIER_MOTEUR_DROIT.2 35.61,70.43 MD-CBS1.2 34.6,64.45 MOTEUR_DROIT.2
N$10
  Bottom 2.184: BORNIER_MOTEUR_DROIT.1 44.45,74.27 MD-CBS2.2 48.2,64.19 MOTEUR_DROIT.10
N$11
  Bottom 2.184: BORNIER_MOTEUR_GAUCHE.1 24.13,73 MG-CBS2.2 27.88,64.19 MOTEUR_GAUCHE.10
N$12
  Bottom 2.184: MOTEUR_GAUCHE.2 14.28,64.45 MG-CBS1.2 13.97,71.75 13.97,78.05 BORNIER_MOTEUR_GAUCHE.2
N$13
  Bottom 0.813: MONTE-PLOT.11 71.12,57.44 71.12,66.67 MP-CBS2.1
N$14
  Bottom 0.813: MOTEUR_GAUCHE.3 15.98,54.5 MG-PU-DIR.2
N$15
  Bottom 0.813: MOTEUR_GAUCHE.5 19.38,54.31 MG-PU-PWM.2
N$16
  Bottom 0.813: MOTEUR_DROIT.3 36.3,54.5 MD-PU-DIR.2
N$17
  Bottom 0.813: MOTEUR_DROIT.5 39.7,54.31 MD-PU-PWM.2
N$18
  Bottom 2.184: BORNIER_MONTE-PLOT.1 64.77,74.27 MP-CBS2.2 68.52,64.19 MONTE-PLOT.10
N$19
  Bottom 2.184: BORNIER_MONTE-PLOT.2 55.93,70.43 MP-CBS1.2 54.92,64.45 MONTE-PLOT.2
N$20
  Bottom 0.813: MONTE-PLOT.3 56.62,54.5 MP-PU-DIR.2
N$21
  Bottom 0.813: MONTE-PLOT.5 60.02,54.31 MP-PU-PWM.2
N$22
  Bottom 0.813: LED4.K R10.2
N$23
  Bottom 2.184: BORNIER_LI-PO.2 ARRET_URGENCE.1
N$24
  Bottom 0.813: K5.A1 68.58,13.14 D5.A 69.85,18.41 T1.C
N$25
  Bottom 0.813: R1.1 76.2,20.96 | 76.2,20.96 R2.2 | D2.C D1.C 76.2,20.96
N$26
  Bottom 0.813: T1.B D1.A R3.2
N$27
  Bottom 0.813: R5.2 D2.A T2.B
N$28
  Bottom 0.813: BUZZER.1 41.94,13.36 43.81,15.24 61.59,15.24 69.09,22.73 82.55,22.73 | T2.C 82.55,19.69 82.55,22.73 | 100.33,22.23 102.62,24.51 R7.2 | 100.33,22.23 100.33,19.69 T4.C 102.87,18.41 104.14,17.14 104.14,12.07 97.79,5.71 73.66,5.71 LED1.A | 100.33,22.23 100.33,22.73 91.44,22.73 | T3.C 91.44,19.69 91.44,22.73 | 82.55,22.73 91.44,22.73
N$29
  Bottom 0.813: R2.1 R4.2 86.36,19.69 D3.C
N$30
  Bottom 0.813: LED2.A 81.92,11.43 90.81,11.43 T3.E
N$31
  Bottom 0.813: D3.A 90.17,15.88 | 90.17,15.88 T3.B | R6.2 90.17,15.88
N$32
  Bottom 0.813: LED3.A 88.27,10.16 98.42,10.16 T4.E
N$33
  Bottom 0.813: R4.1 R9.2 95.25,19.69 D4.C
N$34
  Bottom 0.813: R8.2 D4.A T4.B
N$38
  Bottom 2.184: DIODE24V.A 21.59,22.23 26.67,17.14 26.67,12.12 ARRET_URGENCE.2
UART_AX12
  Bottom 0.813: AX12-7.3 AX12-8.3 1.27,87 2.54,88.26 91.44,88.26 92.71,87 AX12-3.3 AX12-4.3 AX12-5.3 AX12-6.3 156.21,87 157.48,88.26 205.74,88.26 | 205.74,88.26 246.38,88.26 247.65,87 AX12-2.3 AX12-1.3 | U$1.P$14 U$1.P$13 187.96,73.03 191.77,76.84 200.66,76.84 204.47,80.65 204.47,83.19 205.74,84.46 205.74,88.26
UART_JAUNE
  Bottom 0.813: U$1.P$73 175.26,24.77 176.53,26.04 232.41,26.04 233.68,24.77 UART_RASPBE.3
UART_ROUGE
  Bottom 0.813: UART_RASPBE.2 231.14,23.5 229.87,24.77 179.07,24.77 177.8,23.5 177.8,20.96 U$1.P$74

### Text on the board
Bottom: S&G Cie | INTech